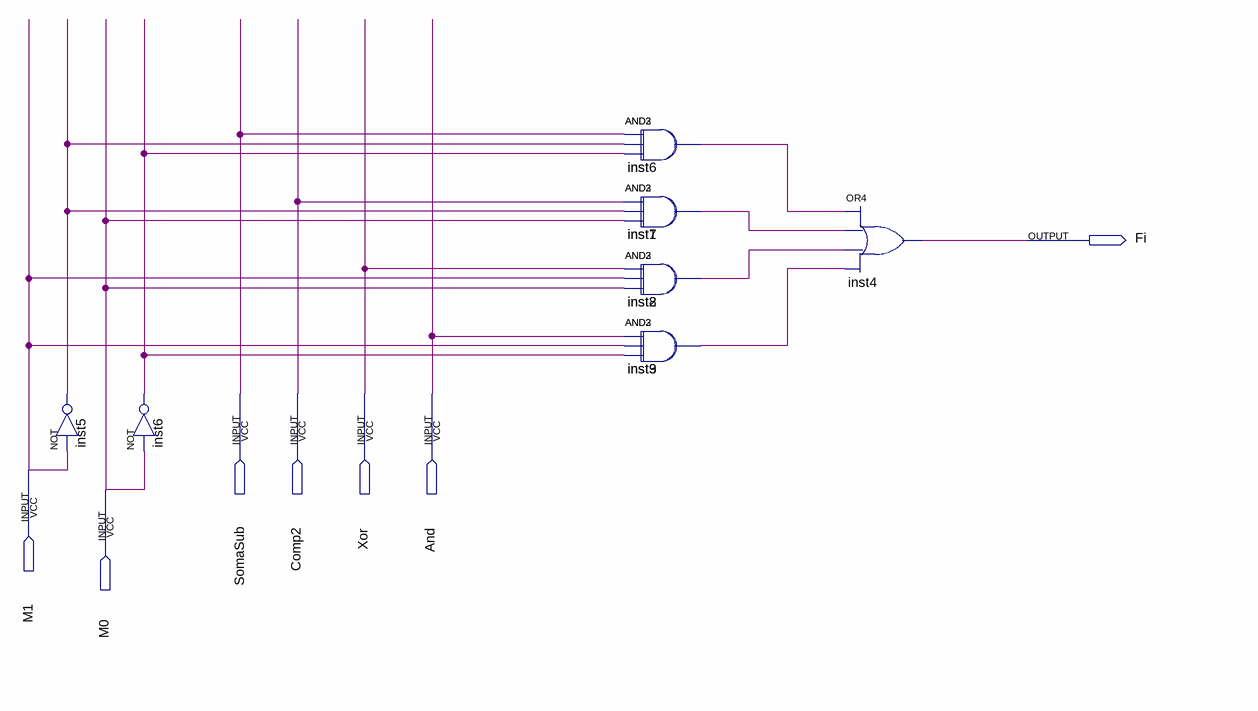
[diagram p0: schematic sheet]
// Quartus schematic MUXcima.bdf as structural Verilog: 11 symbols, 7 pins
module MUXcima (
  input  SomaSub,
  input  Comp2,
  input  Xor,
  input  And,
  input  M1,
  input  M0,
  output Fi
);

  wire inst1_out, inst2_out, inst3_out, inst5_out, inst6_out, inst_out;

  not inst5 (inst5_out, M1);
  not inst6 (inst6_out, M0);
  and inst (inst_out, SomaSub, inst6_out);
  and inst6_dup2 (inst_out, SomaSub, inst5_out, inst6_out);
  and inst1 (inst1_out, Comp2, M0);
  and inst7 (inst1_out, Comp2, inst5_out, M0);
  and inst2 (inst2_out, Xor, M0);
  and inst8 (inst2_out, Xor, M1, M0);
  and inst3 (inst3_out, And, inst6_out);
  and inst9 (inst3_out, And, M1, inst6_out);
  or inst4 (Fi, inst_out, inst1_out, inst2_out, inst3_out);
endmodule
